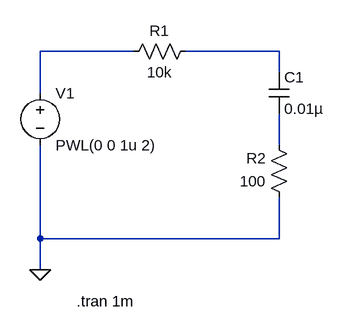
[diagram p0: schematic Draft2.asc]
Draft2.asc, the LTspice schematic file:
Version 4
SHEET 1 880 680
WIRE 208 48 64 48
WIRE 432 48 288 48
WIRE 432 80 432 48
WIRE 64 112 64 48
WIRE 432 192 432 144
WIRE 64 336 64 192
WIRE 432 336 432 272
WIRE 432 336 64 336
WIRE 64 384 64 336
FLAG 64 384 0
SYMBOL voltage 64 96 R0
WINDOW 123 0 0 Left 0
WINDOW 39 0 0 Left 0
SYMATTR InstName V1
SYMATTR Value PWL(0 0 1u 2)
SYMBOL res 304 32 R90
WINDOW 0 0 56 VBottom 2
WINDOW 3 32 56 VTop 2
SYMATTR InstName R1
SYMATTR Value 10k
SYMBOL res 448 288 R180
WINDOW 0 36 76 Left 2
WINDOW 3 36 40 Left 2
SYMATTR InstName R2
SYMATTR Value 100
SYMBOL cap 416 80 R0
SYMATTR InstName C1
SYMATTR Value 0.01µ
TEXT 120 432 Left 2 !.tran 1m

The netlist it stands for:
* Draft2.asc
V1 N001 0 PWL(0 0 1u 2)
R1 N002 N001 10k
R2 0 N003 100
C1 N002 N003 0.01µ
.tran 1m
.backanno
.end